# Altium schematic sheet 05_CONN.SchDoc
size A4
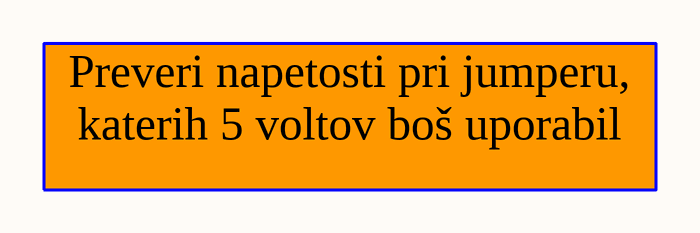
[diagram p0: 05_CONN.SchDoc]

## Notes on the sheet
- Preveri napetosti pri jumperu, katerih 5 voltov boš uporabil